# Altium schematic sheet Arak-Mux.SchDoc
size A4
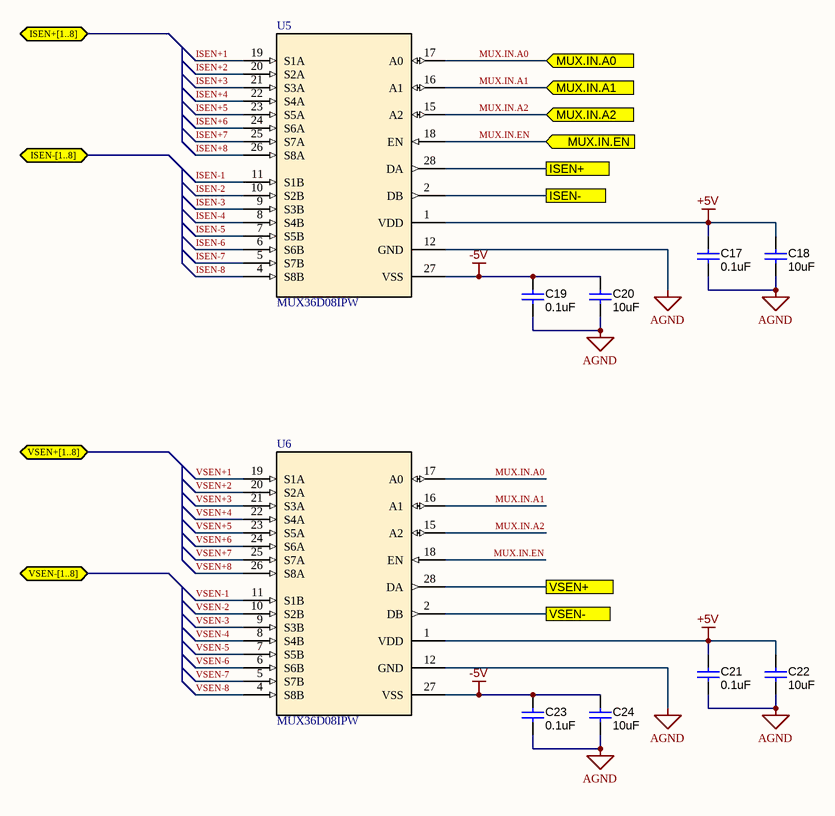
[diagram p0: Arak-Mux.SchDoc]

## Parts
C17  ValueDisplayed: 0.1uF  [0603]  (hidden comment: Capacitor)
C18  ValueDisplayed: 10uF  [0805_HV]  (hidden comment: Capacitor)
C19  ValueDisplayed: 0.1uF  [0603]  (hidden comment: Capacitor)
C20  ValueDisplayed: 10uF  [0805_HV]  (hidden comment: Capacitor)
C21  ValueDisplayed: 0.1uF  [0603]  (hidden comment: Capacitor)
C22  ValueDisplayed: 10uF  [0805_HV]  (hidden comment: Capacitor)
C23  ValueDisplayed: 0.1uF  [0603]  (hidden comment: Capacitor)
C24  ValueDisplayed: 10uF  [0805_HV]  (hidden comment: Capacitor)
U5  MUX36D08IPW  [PW0016A_N]
U6  MUX36D08IPW  [PW0016A_N]

## Ports
ISEN+, ISEN+[1..8] (bidir), ISEN-, ISEN-[1..8] (bidir), MUX.IN.A0 (in), MUX.IN.A1 (in), MUX.IN.A2 (in), MUX.IN.EN (in), VSEN+, VSEN+[1..8] (bidir), VSEN-, VSEN-[1..8] (bidir)

## Nets
+5V: C17.1 C18.1 C21.1 C22.1 U5.1(VDD) U6.1(VDD)
-5V: C19.1 C20.1 C23.1 C24.1 U5.27(VSS) U6.27(VSS)
AGND: C17.2 C18.2 C19.2 C20.2 C21.2 C22.2 C23.2 C24.2 U5.12(GND) U6.12(GND)
ISEN+: U5.28(DA) ; port ISEN+
ISEN+1: U5.19(S1A)
ISEN+2: U5.20(S2A)
ISEN+3: U5.21(S3A)
ISEN+4: U5.22(S4A)
ISEN+5: U5.23(S5A)
ISEN+6: U5.24(S6A)
ISEN+7: U5.25(S7A)
ISEN+8: U5.26(S8A)
ISEN-: U5.2(DB) ; port ISEN-
ISEN-1: U5.11(S1B)
ISEN-2: U5.10(S2B)
ISEN-3: U5.9(S3B)
ISEN-4: U5.8(S4B)
ISEN-5: U5.7(S5B)
ISEN-6: U5.6(S6B)
ISEN-7: U5.5(S7B)
ISEN-8: U5.4(S8B)
MUX.IN.A0: U5.17(A0) U6.17(A0) ; port MUX.IN.A0
MUX.IN.A1: U5.16(A1) U6.16(A1) ; port MUX.IN.A1
MUX.IN.A2: U5.15(A2) U6.15(A2) ; port MUX.IN.A2
MUX.IN.EN: U5.18(EN) U6.18(EN) ; port MUX.IN.EN
VSEN+: U6.28(DA) ; port VSEN+
VSEN+1: U6.19(S1A)
VSEN+2: U6.20(S2A)
VSEN+3: U6.21(S3A)
VSEN+4: U6.22(S4A)
VSEN+5: U6.23(S5A)
VSEN+6: U6.24(S6A)
VSEN+7: U6.25(S7A)
VSEN+8: U6.26(S8A)
VSEN-: U6.2(DB) ; port VSEN-
VSEN-1: U6.11(S1B)
VSEN-2: U6.10(S2B)
VSEN-3: U6.9(S3B)
VSEN-4: U6.8(S4B)
VSEN-5: U6.7(S5B)
VSEN-6: U6.6(S6B)
VSEN-7: U6.5(S7B)
VSEN-8: U6.4(S8B)

## Library data of the parts
C17 C19 C21 C23 = CMP-0006752-5: CAP, CERM, 0.1 uF, 25 V, +/- 5%, X7R, 0603; PartNumber: 06033C104JAT2A; Manufacturer: AVX; Polarized: N; Value: 0.1uF; U/M: EA; Cap_F: 100nF; ESR_ohm: 0.05; Value1: 0.05 ohm; VDC_V: 25V; TaMin_C: -55°C; TaMax_C: 125°C; AEC Category: Q200; SizeArea_mm2: 1.28; SizeAreaWB_mm2: 4.68; SizeX_mm: 1.6; SizeY_mm: 0.8; SizeZ_mm: 1; CompType: Capacitor; PackageReference: 0603; RoHS: Y; Tolerance_%: 5%; Value2: 25V; MountType: SMT; Technology: Ceramic; TempCo: X7R; Cap_Case: 0603; Published: 2008-06-19; Publisher: Texas Instruments; LatestRevisionDate: 2017-03-09; ComponentLink1Description: Datasheet link; ComponentLink1URL: http://datasheets.avx.com/X7RDielectric.pdf; Supplier 1: Digi-Key; Supplier Part Number 1: 478-3713-1-ND; Supplier 2: Mouser; Supplier Part Number 2: 581-06033C104JAT2A; Supplier 3: Farnell; Supplier Part Number 3: 1740614; AEC Qualified: N; AEC Grade: N/A
C18 C20 C22 C24 = CMP-0008315-2: CAP, CERM, 10 uF, 10 V, +/- 10%, X7R, 0805; PartNumber: GRM21BR71A106KE51L; Manufacturer: MuRata; Polarized: N; Value: 10uF; U/M: EA; Cap_F: 10µF; ESR_ohm: 3m; Value1: 0.003 ohm; VDC_V: 10V; TaMin_C: -55°C; TaMax_C: 125°C; Cap_Case: 0805; AEC Category: Q200; SizeArea_mm2: 2.5; SizeAreaWB_mm2: 6.75; SizeX_mm: 2; SizeY_mm: 1.25; SizeZ_mm: 1.45; CompType: Capacitor; PackageReference: 0805; RoHS: Y; Tolerance_%: 10%; Value2: 10V; MountType: SMT; Technology: Ceramic; TempCo: X7R; Published: 2008-06-19; Publisher: Texas Instruments; LatestRevisionDate: 2017-03-09; ComponentLink1Description: Datasheet link; ComponentLink1URL: http://search.murata.co.jp/Ceramy/PnsearchViewAction.do?HnOFG=ON&HnNFG=ON&SEL_CNT=50&sLang=en&sKey=GRM21BR71A106KE51L&x=9&y=9&search=startwith; Supplier 1: Digi-Key; Supplier Part Number 1: 490-3905-1-ND; Supplier 2: Mouser; Supplier Part Number 2: 81-GRM21BR71A106KE51; Supplier 3: Farnell; Supplier Part Number 3: 1828828; AEC Qualified: ?
U5 U6 = MUX36D08IPW: No Description Available; PartNumber: MUX36S08IPWR; Manufacturer: Texas Instruments; RefDes: RefDes; Type: DEV; Value: Value; Copyright: Copyright (C) 2018 Accelerated Designs. All rights reserved